# EAGLE schematic 13A-001 (EAGLE 9.6.2)
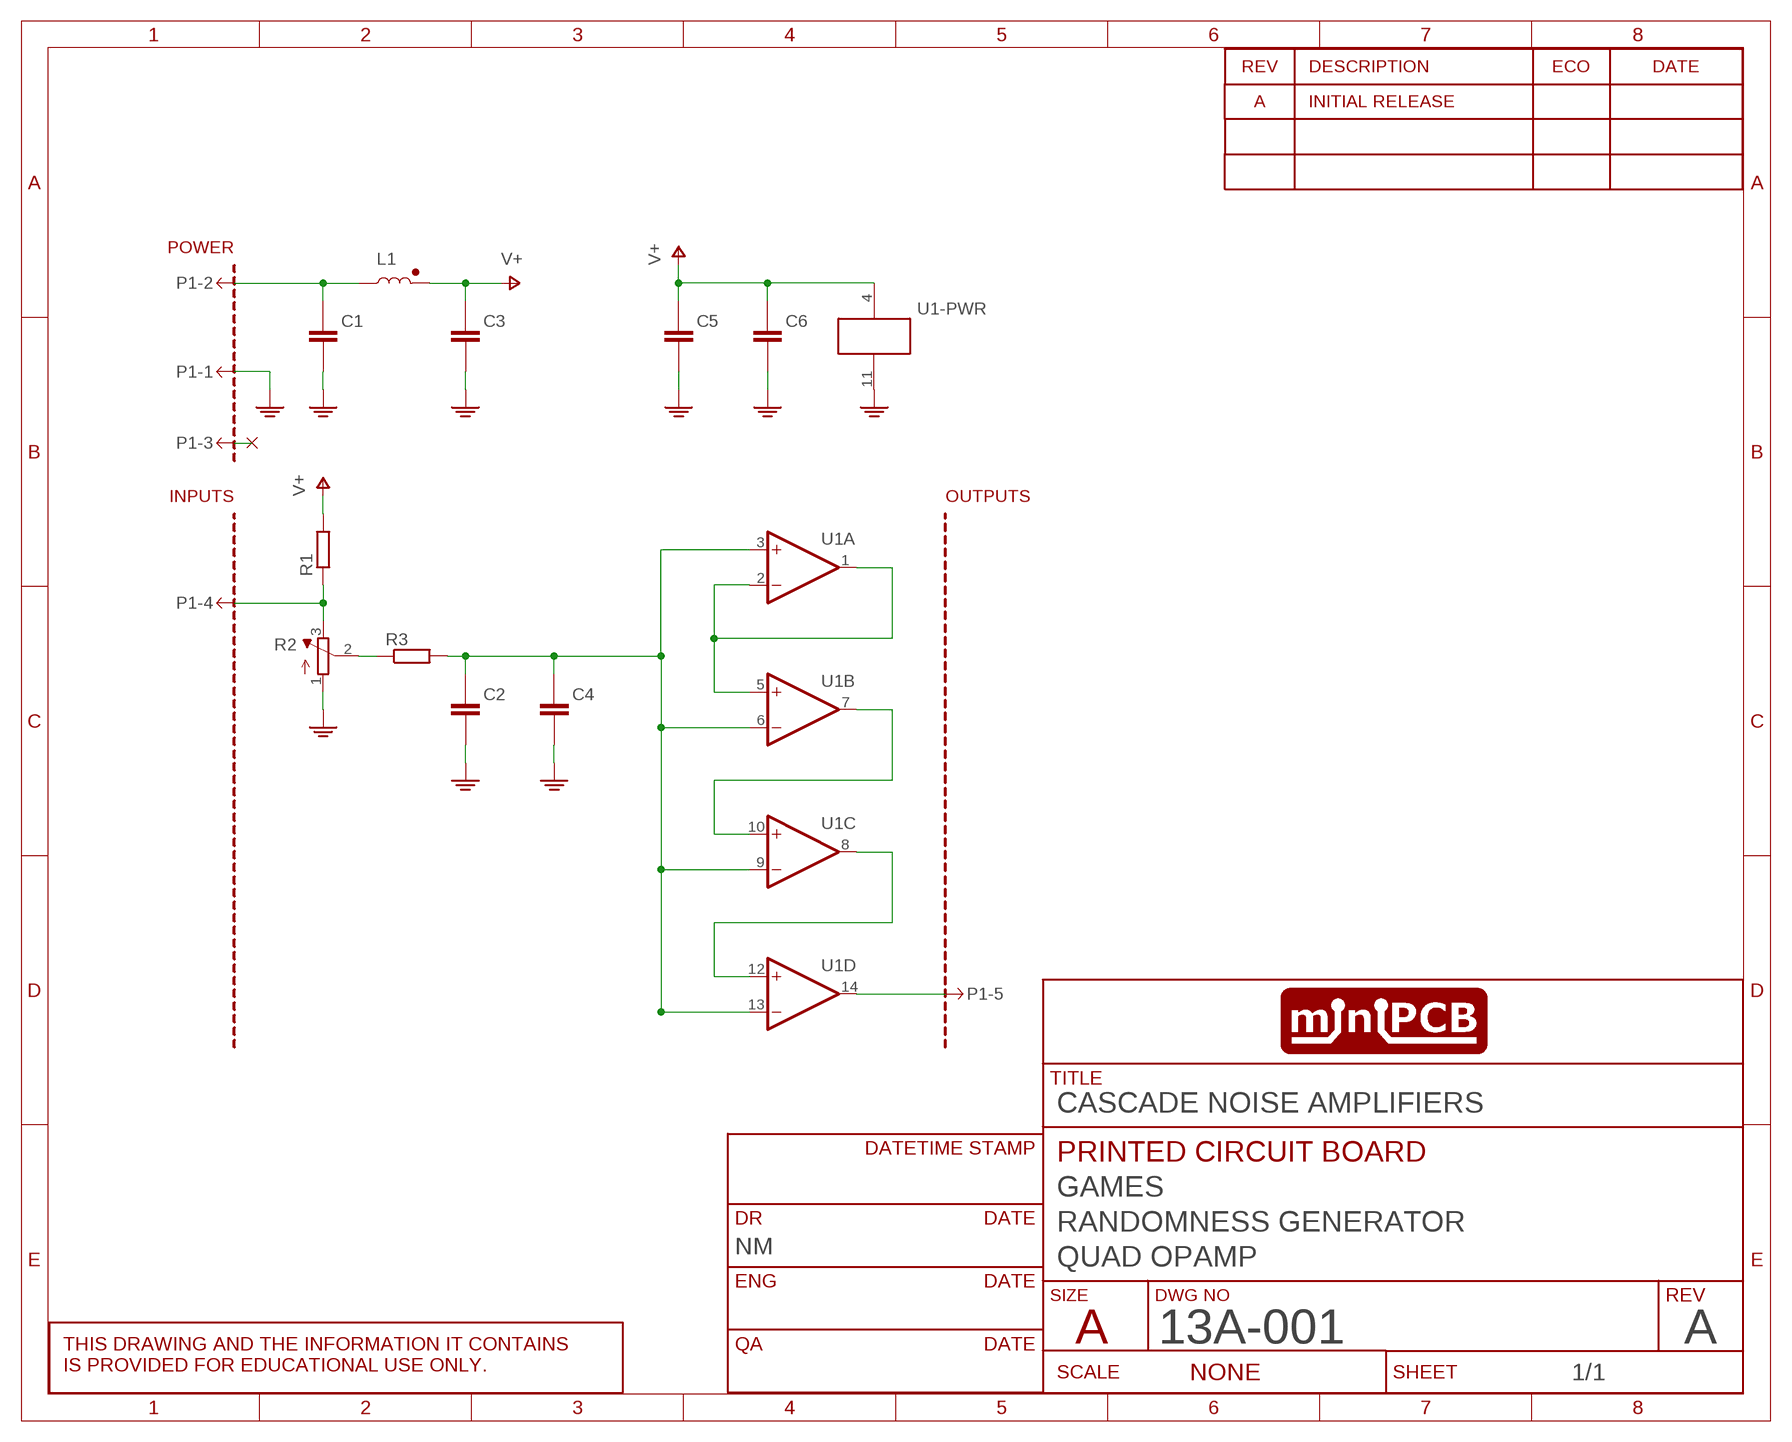
[diagram p0: schematic, sheet 1]
SHEET1 (SCHEMATIC): CIRCUIT_CATEGORY: GAMES; CIRCUIT_NAME: RANDOMNESS GENERATOR; CIRCUIT_VARIANT: QUAD OPAMP; DR: NM; PCB_PCBA: PRINTED CIRCUIT BOARD; REVA: A; REVISION: A; TITLE: CASCADE NOISE AMPLIFIERS

## Parts
C1  CAPACITOR_10  [C5MM]
C2  CAPACITORTHD  [C050-024X044]
C3  CAPACITOR_10  [C5MM]
C4  CAPACITORTHD  [C050-024X044]
C5  CAPACITORTHD  [C050-024X044]
C6  CAPACITORTHD  [C050-024X044]
L1  INDUCTORRFS1113  [L/RFS1113]
P1-  MINIPCB_5P50X50  [MINIPCB_5P_50X50MM]
R1  RESISTORTHD  [0204/10]
R2  TRIMPOT0.100THD  [TRIM_0100]
R3  RESISTORTHD  [0204/10]
U1  OPAMP_QUADTHD  [DIL14]

## Nets
GND: C1.- C2.2(-) C3.- C4.2(-) C5.2(-) C6.2(-) P1-.1 R2.1(A) U1.11(-PWR:V-)
N$1: P1-.4 R1.1 R2.3(E)
N$2: R2.2(S) R3.1
N$3: C2.1(+) C4.1(+) R3.2 U1.3(A:+IN) U1.6(B:-IN) U1.9(C:-IN) U1.13(D:-IN)
N$4: U1.1(A:OUT) U1.2(A:-IN) U1.5(B:+IN)
N$5: C1.+ L1.2 P1-.2
N$6: U1.7(B:OUT) U1.10(C:+IN)
N$7: U1.8(C:OUT) U1.12(D:+IN)
N$8: P1-.5 U1.14(D:OUT)
N$11: P1-.3
V+: C3.+ C5.1(+) C6.1(+) L1.1 R1.2 U1.4(-PWR:V+)

## Library data of the parts
C1-C6 = minipcb:CAPACITOR
L1 = minipcb:INDUCTOR
P1- = minipcb:MINIPCB_5P; REVISION: A
R1 R3 = minipcb:RESISTOR
R2 = minipcb:TRIMPOT: SMT trimmer potentiometer part number TC33X http://www.ladyada.net/library/eagle
U1 = minipcb:OPAMP_QUAD: OP AMP